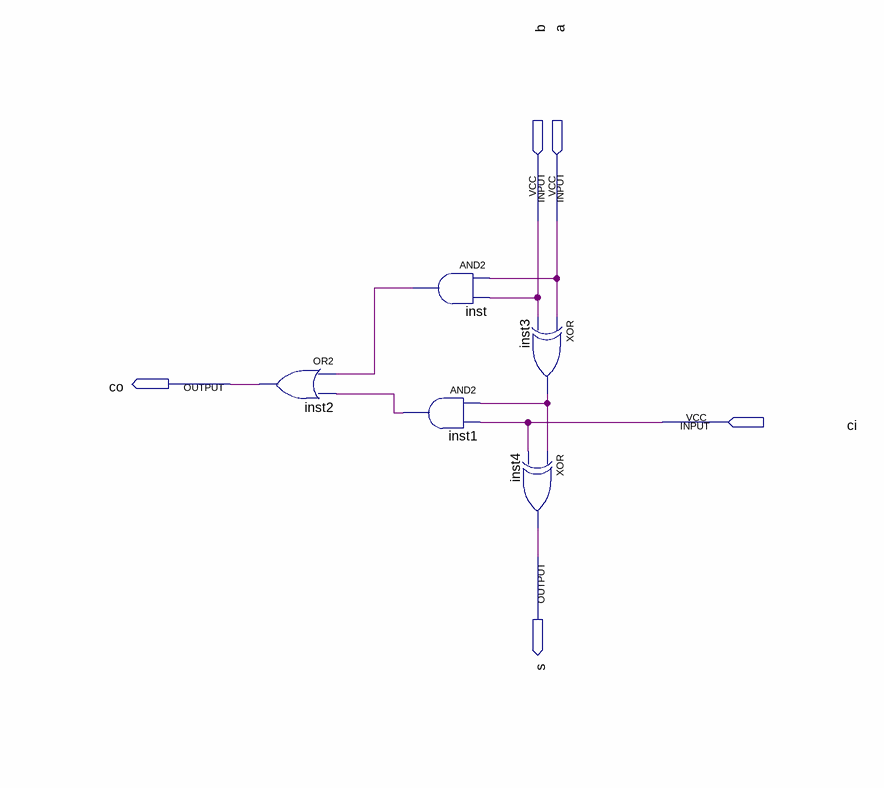
[diagram p0: schematic sheet]
// Quartus schematic full_add.bdf as structural Verilog: 5 symbols, 5 pins
module full_add (
  input  b,
  input  a,
  input  ci,
  output co,
  output s
);

  wire inst1_out, inst3_out, inst_out;

  or inst2 (co, inst_out, inst1_out);
  and inst1 (inst1_out, inst3_out, ci);
  and inst (inst_out, a, b);
  xor inst3 (inst3_out, a, b);
  xor inst4 (s, inst3_out, ci);
endmodule
